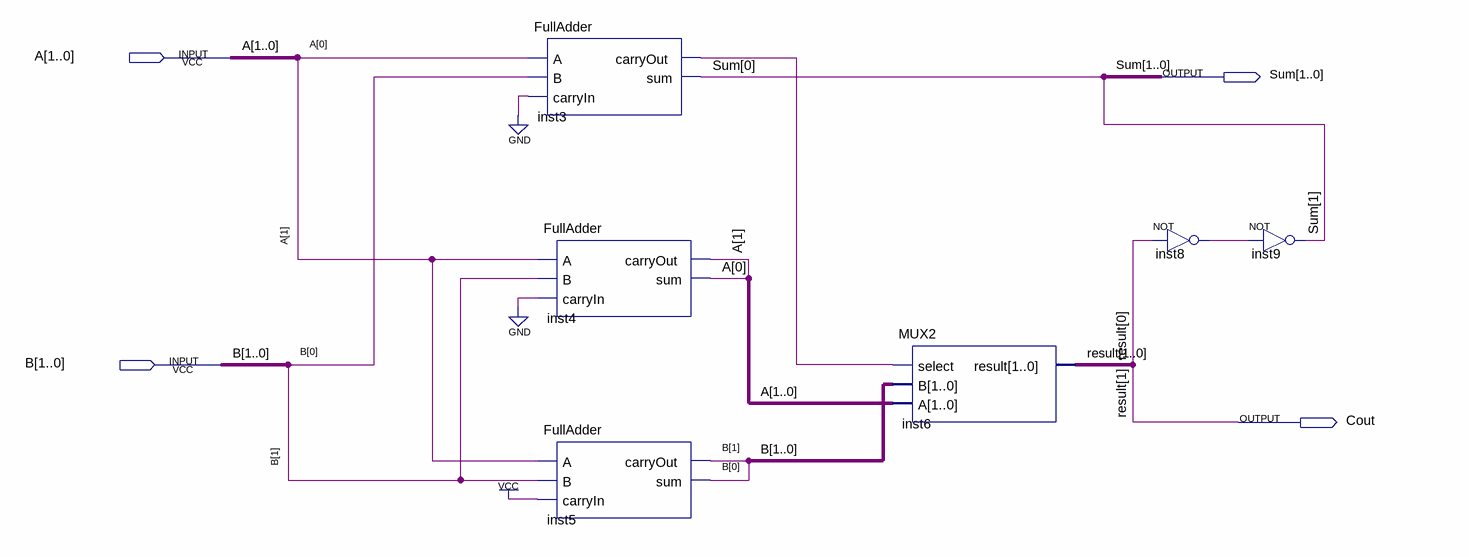
[diagram p0: schematic sheet]
// Quartus schematic CSA2.bdf as structural Verilog: 6 symbols, 4 pins
module CSA2 (
  input  [1:0] A,
  input  [1:0] B,
  output [1:0] Sum,
  output Cout
);

  wire inst3_carryout, inst8_out;
  wire [0:0] result;

  FullAdder inst3 (.A(A[0]), .B(B[0]), .carryIn(1'b0), .carryOut(inst3_carryout), .sum(Sum[0]));
  FullAdder inst4 (.A(A[1]), .B(B[1]), .carryIn(1'b0), .carryOut(A[1]), .sum(A[0]));
  FullAdder inst5 (.A(A[1]), .B(B[1]), .carryIn(1'b1), .carryOut(B[1]), .sum(B[0]));
  MUX2 inst6 (.select(inst3_carryout), .B(B), .A(A), .result({Cout, result[0]}));
  not inst8 (inst8_out, result[0]);
  not inst9 (Sum[1], inst8_out);

  // Other names for the same wires on the sheet: result[1] = Cout
endmodule
